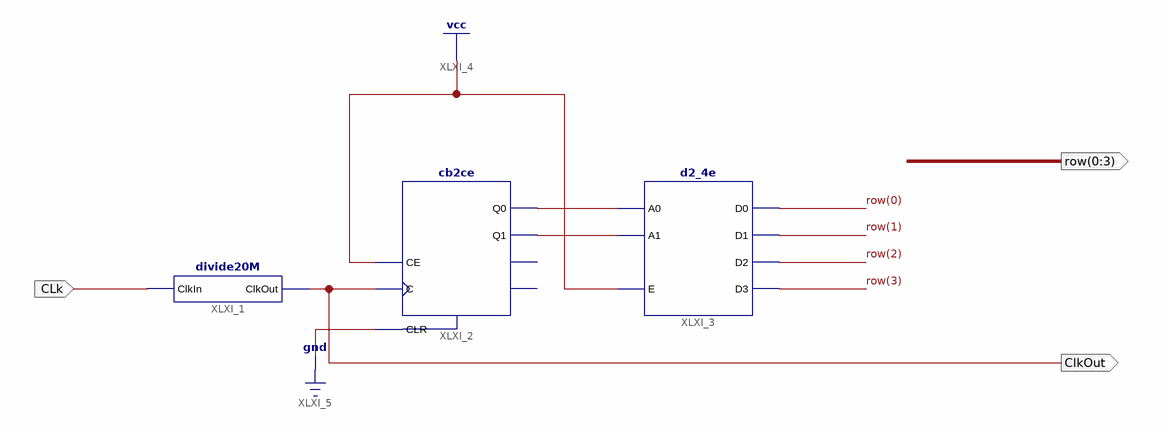
[diagram p0: schematic sheet 1]
// Xilinx ISE schematic clockInRow.sch (spartan6) as structural Verilog: 3 symbols, 3 ports
module clockInRow (
  input  CLk,
  output [0:3] row,
  output ClkOut
);

  wire XLXN_2, XLXN_5;

  divide20M XLXI_1 (.ClkIn(CLk), .ClkOut(ClkOut));
  cb2ce XLXI_2 (.C(ClkOut), .CE(1'b1), .CLR(1'b0), .Q0(XLXN_2), .Q1(XLXN_5));  // open: CEO, TC
  d2_4e XLXI_3 (.A0(XLXN_2), .A1(XLXN_5), .E(1'b1), .D0(row[0]), .D1(row[1]), .D2(row[2]), .D3(row[3]));
endmodule
